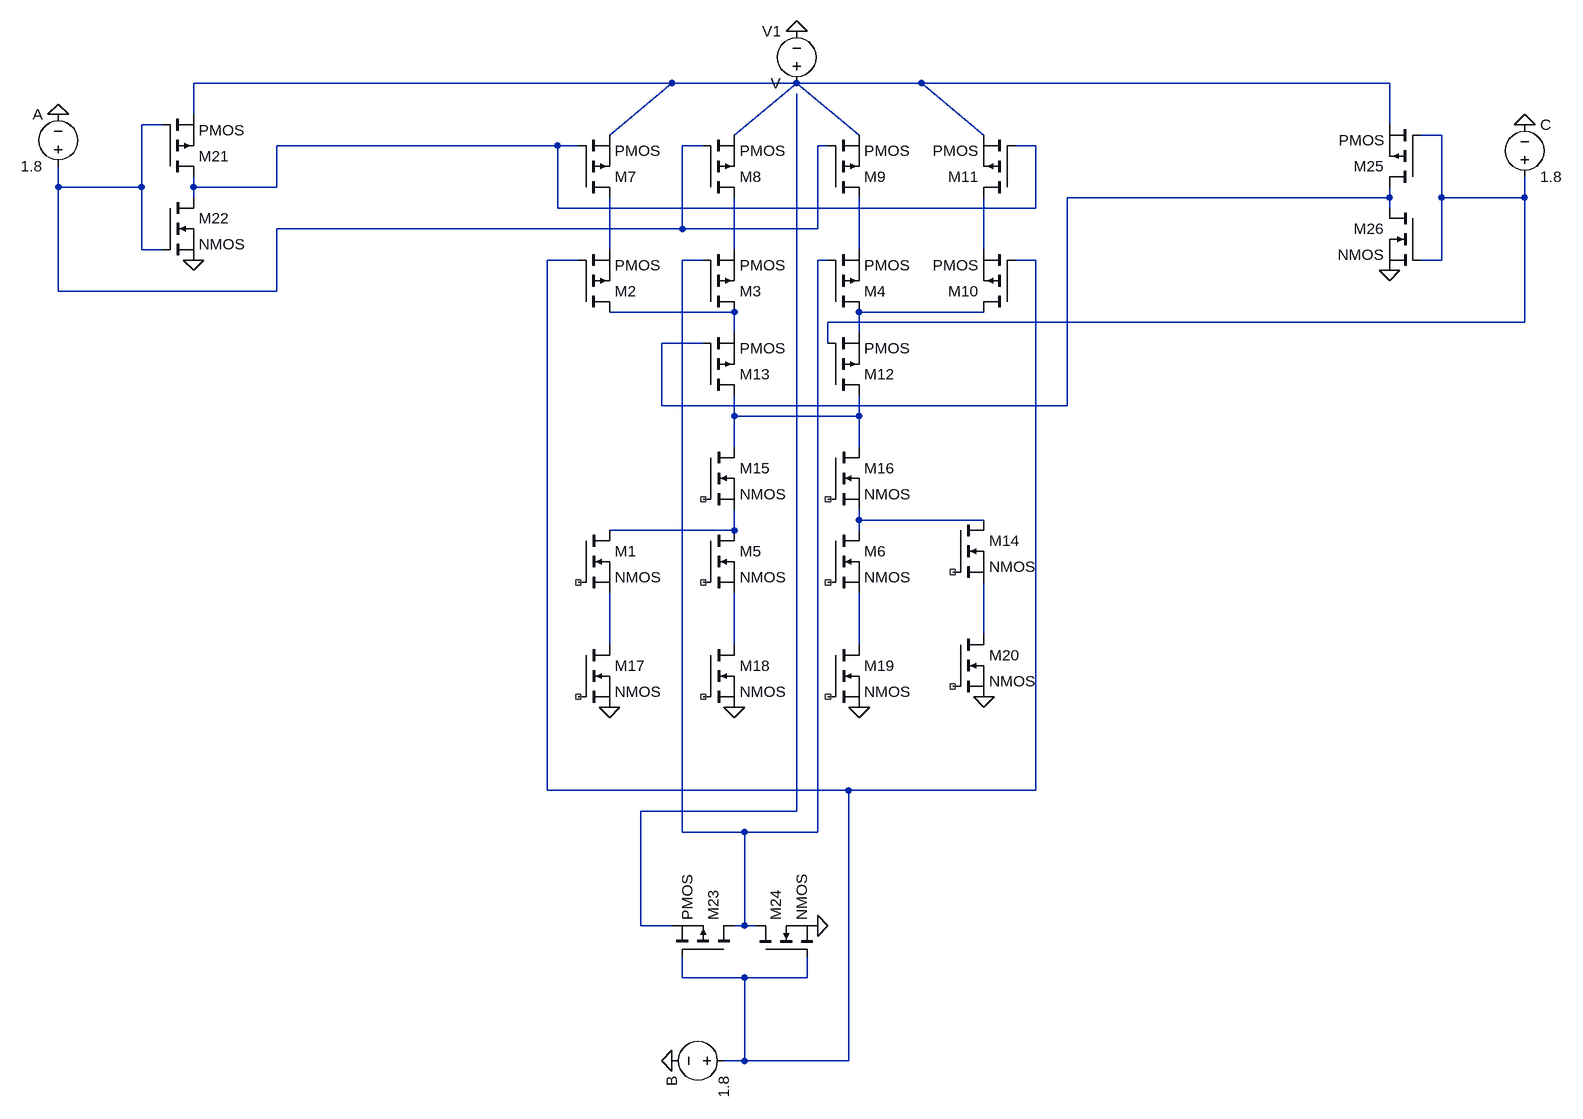
[diagram p0: schematic Draft1.asc]
Draft1.asc, the LTspice schematic file:
Version 4
SHEET 1 1664 1184
WIRE 288 -384 -448 -384
WIRE 480 -384 288 -384
WIRE 672 -384 480 -384
WIRE 1392 -384 672 -384
WIRE -448 -336 -448 -384
WIRE -496 -320 -528 -320
WIRE 1392 -320 1392 -384
WIRE 192 -304 288 -384
WIRE 384 -304 480 -384
WIRE 576 -304 480 -384
WIRE 768 -304 672 -384
WIRE 1472 -304 1440 -304
WIRE 112 -288 -320 -288
WIRE 144 -288 112 -288
WIRE 336 -288 304 -288
WIRE 528 -288 512 -288
WIRE 848 -288 816 -288
WIRE -656 -224 -656 -256
WIRE -528 -224 -528 -320
WIRE -528 -224 -656 -224
WIRE -448 -224 -448 -240
WIRE -320 -224 -320 -288
WIRE -320 -224 -448 -224
WIRE -448 -208 -448 -224
WIRE 1392 -208 1392 -224
WIRE 1392 -208 896 -208
WIRE 1472 -208 1472 -304
WIRE 1600 -208 1600 -240
WIRE 1600 -208 1472 -208
WIRE 112 -192 112 -288
WIRE 848 -192 848 -288
WIRE 848 -192 112 -192
WIRE 1392 -192 1392 -208
WIRE 304 -160 304 -288
WIRE 304 -160 -320 -160
WIRE 512 -160 512 -288
WIRE 512 -160 304 -160
WIRE -528 -128 -528 -224
WIRE -496 -128 -528 -128
WIRE 192 -128 192 -208
WIRE 384 -128 384 -208
WIRE 576 -128 576 -208
WIRE 768 -128 768 -208
WIRE 144 -112 96 -112
WIRE 336 -112 304 -112
WIRE 528 -112 512 -112
WIRE 848 -112 816 -112
WIRE 1472 -112 1472 -208
WIRE 1472 -112 1440 -112
WIRE -656 -64 -656 -224
WIRE -320 -64 -320 -160
WIRE -320 -64 -656 -64
WIRE 384 -32 192 -32
WIRE 768 -32 576 -32
WIRE 1600 -16 1600 -208
WIRE 1600 -16 528 -16
WIRE 384 0 384 -32
WIRE 576 0 576 -32
WIRE 336 16 272 16
WIRE 528 16 528 -16
WIRE 272 112 272 16
WIRE 896 112 896 -208
WIRE 896 112 272 112
WIRE 384 128 384 96
WIRE 576 128 576 96
WIRE 576 128 384 128
WIRE 384 176 384 128
WIRE 576 176 576 128
WIRE 576 288 576 272
WIRE 768 288 576 288
WIRE 384 304 384 272
WIRE 384 304 192 304
WIRE 576 304 576 288
WIRE 768 464 768 384
WIRE 192 480 192 400
WIRE 384 480 384 400
WIRE 576 480 576 400
WIRE 96 704 96 -112
WIRE 560 704 96 704
WIRE 848 704 848 -112
WIRE 848 704 560 704
WIRE 480 736 480 -368
WIRE 480 736 240 736
WIRE 304 768 304 -112
WIRE 400 768 304 768
WIRE 512 768 512 -112
WIRE 512 768 400 768
WIRE 240 912 240 736
WIRE 288 912 240 912
WIRE 400 912 400 768
WIRE 400 912 384 912
WIRE 416 912 400 912
WIRE 304 992 304 960
WIRE 400 992 304 992
WIRE 496 992 496 960
WIRE 496 992 400 992
WIRE 400 1120 400 992
WIRE 400 1120 368 1120
WIRE 560 1120 560 704
WIRE 560 1120 400 1120
FLAG 768 560 0
FLAG 576 576 0
FLAG 384 576 0
FLAG 192 576 0
FLAG 480 -464 0
FLAG -656 -336 0
FLAG -448 -112 0
FLAG 288 1120 0
FLAG 512 912 0
FLAG 1600 -320 0
FLAG 1392 -96 0
SYMBOL nmos 144 304 R0
SYMATTR InstName M1
SYMBOL pmos 144 -32 M180
SYMATTR InstName M2
SYMBOL pmos 336 -32 M180
SYMATTR InstName M3
SYMBOL pmos 528 -32 M180
SYMATTR InstName M4
SYMBOL nmos 336 304 R0
SYMATTR InstName M5
SYMBOL nmos 528 304 R0
SYMATTR InstName M6
SYMBOL pmos 144 -208 M180
SYMATTR InstName M7
SYMBOL pmos 336 -208 M180
SYMATTR InstName M8
SYMBOL pmos 528 -208 M180
SYMATTR InstName M9
SYMBOL pmos 816 -32 R180
SYMATTR InstName M10
SYMBOL pmos 816 -208 R180
SYMATTR InstName M11
SYMBOL pmos 528 96 M180
SYMATTR InstName M12
SYMBOL pmos 336 96 M180
SYMATTR InstName M13
SYMBOL nmos 720 288 R0
SYMATTR InstName M14
SYMBOL nmos 336 176 R0
SYMATTR InstName M15
SYMBOL nmos 528 176 R0
SYMATTR InstName M16
SYMBOL nmos 144 480 R0
SYMATTR InstName M17
SYMBOL nmos 336 480 R0
SYMATTR InstName M18
SYMBOL nmos 528 480 R0
SYMATTR InstName M19
SYMBOL nmos 720 464 R0
SYMATTR InstName M20
SYMBOL voltage 480 -368 R180
WINDOW 0 24 96 Left 2
WINDOW 3 24 16 Left 2
SYMATTR InstName V1
SYMBOL voltage -656 -240 R180
WINDOW 0 24 96 Left 2
WINDOW 3 24 16 Left 2
WINDOW 123 0 0 Left 0
WINDOW 39 0 0 Left 0
SYMATTR InstName A
SYMATTR Value 1.8
SYMBOL pmos -496 -240 M180
SYMATTR InstName M21
SYMBOL nmos -496 -208 R0
SYMATTR InstName M22
SYMBOL voltage 384 1120 R90
WINDOW 0 24 96 Left 2
WINDOW 3 24 16 Left 2
WINDOW 123 0 0 Left 0
WINDOW 39 0 0 Left 0
SYMATTR InstName B
SYMATTR Value 1.8
SYMBOL pmos 384 960 M270
SYMATTR InstName M23
SYMBOL nmos 416 960 R270
SYMATTR InstName M24
SYMBOL voltage 1600 -224 M180
WINDOW 0 24 96 Left 2
WINDOW 3 24 16 Left 2
WINDOW 123 0 0 Left 0
WINDOW 39 0 0 Left 0
SYMATTR InstName C
SYMATTR Value 1.8
SYMBOL pmos 1440 -224 R180
SYMATTR InstName M25
SYMBOL nmos 1440 -192 M0
SYMATTR InstName M26

The netlist it stands for:
* Draft1.asc
M1 N016 NC_01 N018 N018 NMOS
M2 N012 N010 N006 N006 PMOS
M3 N012 N011 N007 N007 PMOS
M4 N013 N011 N008 N008 PMOS
M5 N016 NC_02 N019 N019 NMOS
M6 N015 NC_03 N020 N020 NMOS
M7 N006 N004 N001 N001 PMOS
M8 N007 N002 N001 N001 PMOS
M9 N008 N002 N001 N001 PMOS
M10 N013 N010 N009 N009 PMOS
M11 N009 N004 N001 N001 PMOS
M12 N014 N003 N013 N013 PMOS
M13 N014 N005 N012 N012 PMOS
M14 N015 NC_04 N017 N017 NMOS
M15 N014 NC_05 N016 N016 NMOS
M16 N014 NC_06 N015 N015 NMOS
M17 N018 NC_07 0 0 NMOS
M18 N019 NC_08 0 0 NMOS
M19 N020 NC_09 0 0 NMOS
M20 N017 NC_10 0 0 NMOS
V1 N001 0 V
V§A N002 0 1.8
M21 N004 N002 N001 N001 PMOS
M22 N004 N002 0 0 NMOS
V§B N010 0 1.8
M23 N011 N010 N021 N021 PMOS
M24 N011 N010 0 0 NMOS
V§C N003 0 1.8
M25 N005 N003 N001 N001 PMOS
M26 N005 N003 0 0 NMOS
.model NMOS NMOS
.model PMOS PMOS
.lib standard.mos
.backanno
.end